# Altium schematic sheet Main.SchDoc
size A; SheetNumber: 1; SheetTotal: 4
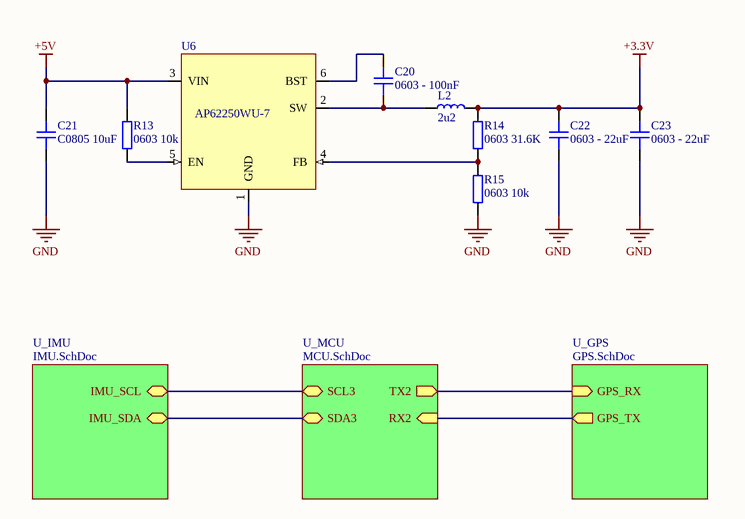
[diagram p0: Main.SchDoc]

## Parts
C20  0603 - 100nF  [CAP_0603]
C21  C0805 10uF  [CAP_0805]
C22  0603 - 22uF  [CAP_0603]
C23  0603 - 22uF  [CAP_0603]
L2  2u2  [SRP0415]
R13  0603 10k  [RES_0603]
R14  0603 31.6K  [RES_0603]
R15  0603 10k  [RES_0603]
U6  AP62250WU-7  [TSOT-26-6]

## Sub-sheets
U_GPS = GPS.SchDoc: GPS_RX (in), GPS_TX (out)
U_IMU = IMU.SchDoc: IMU_SCL (bidir), IMU_SDA (bidir)
U_MCU = MCU.SchDoc: SCL3 (bidir), SDA3 (bidir), TX2 (out), RX2 (in)

## Nets
+3.3V: C22.2 C23.2 L2.2 R14.2
+5V: C21.2 R13.2 U6.3(VIN)
GND: C21.1 C22.1 C23.1 R15.1 U6.1(GND)
NetC20_1: C20.1 L2.1 U6.2(SW)
NetC20_2: C20.2 U6.6(BST)
NetR13_1: R13.1 U6.5(EN)
NetR14_1: R14.1 R15.2 U6.4(FB)
(unnamed): sheet U_MCU/SCL3, sheet U_IMU/IMU_SCL
(unnamed): sheet U_MCU/SDA3, sheet U_IMU/IMU_SDA
(unnamed): sheet U_MCU/TX2, sheet U_GPS/GPS_RX
(unnamed): sheet U_MCU/RX2, sheet U_GPS/GPS_TX

## Library data of the parts
C20 C22 C23 = CAP_0603: Capacitor SMD 0603; Manufacturer: *; Manufacturer Part Number: *; Distributor Link: *; LCSC: *; Rating: *; Dielectric: *
C21 = CAP_0805: Capacitor SMD 0805; Manufacturer: *; Manufacturer Part Number: *; Distributor Link: *; LCSC: *; Rating: *; Dielectric: *
L2 = SRP0415-2R2K: Inductor SMD 2.2uH Bourns SRP0415-2R2K; Manufacturer: Bourns; Manufacturer Part Number: SRP0415-2R2K
R13-R15 = RES_0603: Resistor SMD 0603; Manufacturer: *; Manufacturer Part Number: *; Distributor Link: *; LCSC: *
U6 = AP62250WU-7: 4.2V TO 18V INPUT, 2.5A LOW IQ SYNCHRONOUS BUCK CONVERTER; Manufacturer: Diodes Incorporated; Manufacturer Part Number: AP62250WU-7; Distributor Link: https://www.mouser.de/ProductDetail/Diodes-Incorporated/AP62250WU-7?qs=7MVldsJ5Uax1PUc8sdeimQ%3D%3D